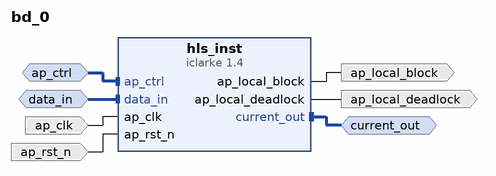
[diagram p0: block diagram of the top level]
# Vivado block design bd_0, xc7z020clg400-1, Vivado 2021.2
create_bd_design bd_0

create_bd_intf_port -mode Slave -vlnv xilinx.com:interface:acc_handshake_rtl:1.0 ap_ctrl
create_bd_intf_port -mode Master -vlnv xilinx.com:interface:axis_rtl:1.0 current_out
set_property -dict {CONFIG.FREQ_HZ 200000000.0} [get_bd_intf_ports current_out]
create_bd_intf_port -mode Slave -vlnv xilinx.com:interface:axis_rtl:1.0 data_in
set_property -dict [list \
  CONFIG.FREQ_HZ 200000000.0 \
  CONFIG.HAS_TKEEP 0 \
  CONFIG.HAS_TLAST 0 \
  CONFIG.HAS_TREADY 1 \
  CONFIG.HAS_TSTRB 0 \
  CONFIG.LAYERED_METADATA undef \
  CONFIG.TDATA_NUM_BYTES 8 \
  CONFIG.TDEST_WIDTH 0 \
  CONFIG.TID_WIDTH 0 \
  CONFIG.TUSER_WIDTH 0 \
] [get_bd_intf_ports data_in]
create_bd_port -dir I -type clk ap_clk
set_property -dict {CONFIG.FREQ_HZ 200000000.0} [get_bd_ports ap_clk]
create_bd_port -dir O ap_local_block
create_bd_port -dir O ap_local_deadlock
create_bd_port -dir I -type rst ap_rst_n

create_bd_cell -type ip -vlnv xilinx.com:hls:iclarke:1.4 hls_inst

# ---- connections ----

connect_bd_intf_net -intf_net ap_ctrl_0_1 [get_bd_intf_ports ap_ctrl] [get_bd_intf_pins hls_inst/ap_ctrl]
connect_bd_intf_net -intf_net data_in_0_1 [get_bd_intf_ports data_in] [get_bd_intf_pins hls_inst/data_in]
connect_bd_intf_net [get_bd_intf_ports current_out] [get_bd_intf_pins hls_inst/current_out]
connect_bd_net -net ap_clk_0_1 [get_bd_ports ap_clk] [get_bd_pins hls_inst/ap_clk]
connect_bd_net -net ap_rst_n_0_1 [get_bd_ports ap_rst_n] [get_bd_pins hls_inst/ap_rst_n]
connect_bd_net [get_bd_pins hls_inst/ap_local_block] [get_bd_ports ap_local_block]
connect_bd_net [get_bd_pins hls_inst/ap_local_deadlock] [get_bd_ports ap_local_deadlock]

validate_bd_design
save_bd_design
